# Altium schematic sheet Connector.SchDoc
size 431 x 279 mm; SheetNumber: 4; SheetTotal: 11
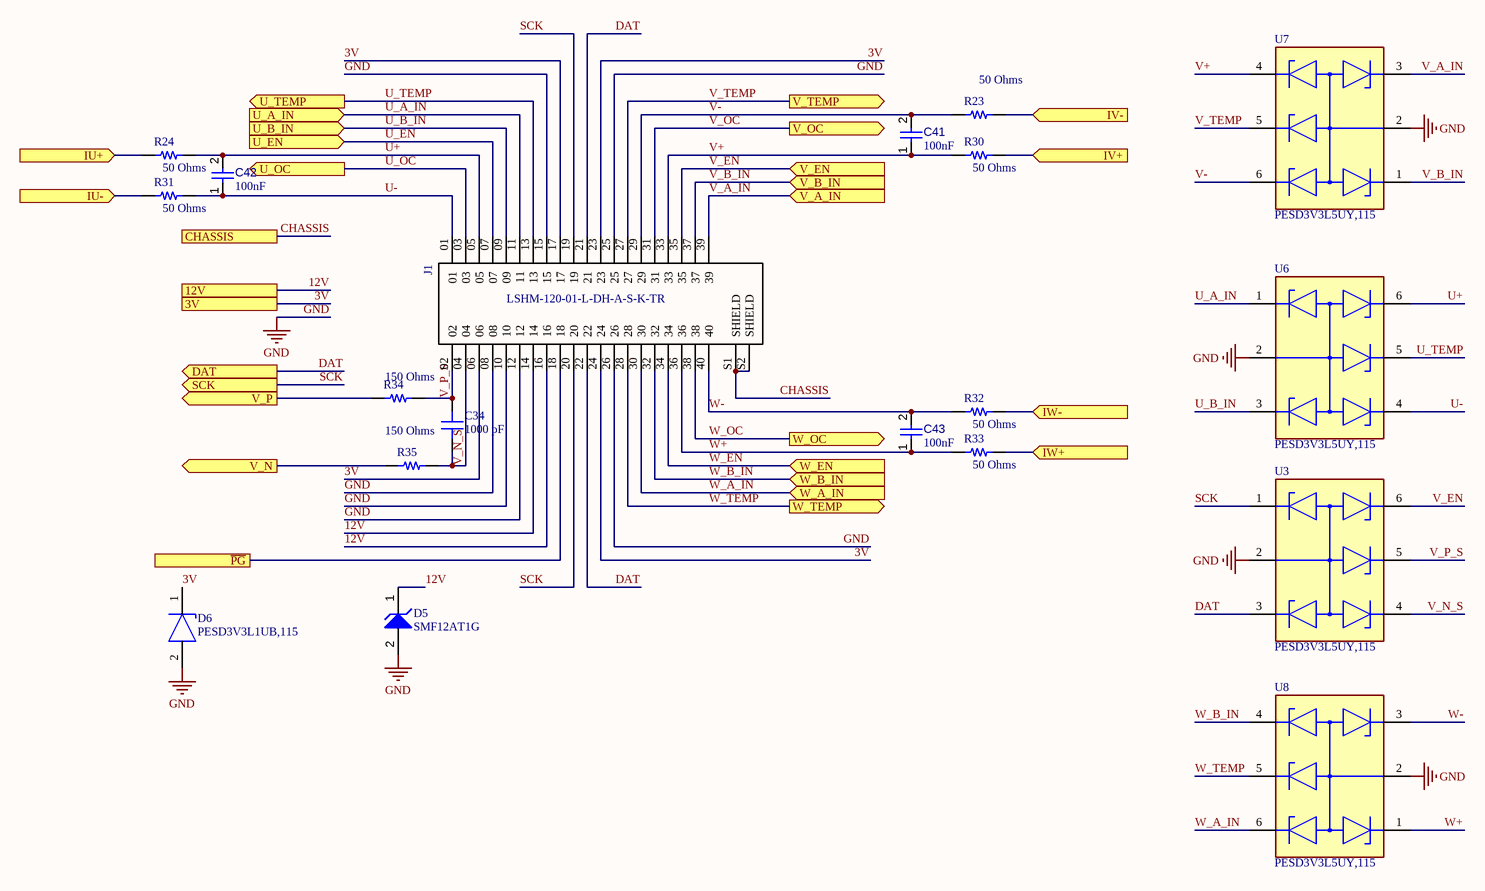
[diagram p0: Connector.SchDoc]

## Parts
C34  1000 pF  [CAP 0402_1005]
C41  value 100nF  [CAPC0402(1005)60_L]  (hidden comment: Capacitor 100nF +/-20% 10V 0402)
C42  value 100nF  [CAPC0402(1005)60_L]  (hidden comment: Capacitor 100nF +/-20% 10V 0402)
C43  value 100nF  [CAPC0402(1005)60_L]  (hidden comment: Capacitor 100nF +/-20% 10V 0402)
D5  SMF12AT1G  [ONSC-SOD-123FL-2-498_V]
D6  PESD3V3L1UB,115  [FP-SOD523-MFG]
J1  LSHM-120-01-L-DH-A-S-K-TR  [*SAMTEC_LSHM-120-01-L-DH-A-S-K-TR_LSHM-120-01-L-DH-A-S-K-TR(Primary)]
R23  50 Ohms  [RES 0402_1005]
R24  50 Ohms  [RES 0402_1005]
R30  50 Ohms  [RES 0402_1005]
R31  50 Ohms  [RES 0402_1005]
R32  50 Ohms  [RES 0402_1005]
R33  50 Ohms  [RES 0402_1005]
R34  150 Ohms  [RES 0402_1005]
R35  150 Ohms  [RES 0402_1005]
U3  PESD3V3L5UY,115  [FP-SOT363-IPC_A]
U6  PESD3V3L5UY,115  [FP-SOT363-IPC_A]
U7  PESD3V3L5UY,115  [FP-SOT363-IPC_A]
U8  PESD3V3L5UY,115  [FP-SOT363-IPC_A]

## Ports
3V, 12V, CHASSIS, DAT (out), IU+ (in), IU- (in), IV+ (in), IV- (in), IW+ (in), IW- (in), SCK (out), U_A_IN (in), U_B_IN (in), U_EN (in), U_OC (out), U_TEMP (out), V_A_IN (in), V_B_IN (in), V_EN (in), V_N (out), V_OC (out), V_P (out), V_TEMP (out), W_A_IN (in), W_B_IN (in), W_EN (in), W_OC (out), W_TEMP (out), ~{PG}

## Nets
GND: D5.2(A) D6.2(A) J1.08 J1.10 J1.12 J1.15 J1.25 J1.26 U3.2(COMMON_ANODE) U6.2(COMMON_ANODE) U7.2(COMMON_ANODE) U8.2(COMMON_ANODE)
3V: D6.1(C) J1.06 J1.17 J1.23 J1.24 ; port 3V
12V: D5.1(K) J1.14 J1.16 ; port 12V
CHASSIS: J1.S1(SHIELD) J1.S2(SHIELD) ; port CHASSIS
DAT: J1.21 J1.22 U3.3(CATHODE(DIODE_2)) ; port DAT
IU+: R24.1 ; port IU+
IU-: R31.1 ; port IU-
IV+: R30.2 ; port IV+
IV-: R23.2 ; port IV-
IW+: R33.2 ; port IW+
IW-: R32.2 ; port IW-
~{PG}: J1.18 ; port ~{PG}
SCK: J1.19 J1.20 U3.1(CATHODE(DIODE_1)) ; port SCK
U+: C42.2 J1.05 R24.2 U6.6(CATHODE(DIODE_5))
U-: C42.1 J1.01 R31.2 U6.4(CATHODE(DIODE_3))
U_A_IN: J1.11 U6.1(CATHODE(DIODE_1)) ; port U_A_IN
U_B_IN: J1.09 U6.3(CATHODE(DIODE_2)) ; port U_B_IN
U_EN: J1.07 ; port U_EN
U_OC: J1.03 ; port U_OC
U_TEMP: J1.13 U6.5(CATHODE(DIODE_4)) ; port U_TEMP
V+: C41.1 J1.33 R30.1 U7.4(CATHODE(DIODE_3))
V-: C41.2 J1.29 R23.1 U7.6(CATHODE(DIODE_5))
V_A_IN: J1.39 U7.3(CATHODE(DIODE_2)) ; port V_A_IN
V_B_IN: J1.37 U7.1(CATHODE(DIODE_1)) ; port V_B_IN
V_EN: J1.35 U3.6(CATHODE(DIODE_5)) ; port V_EN
V_N: R35.1 ; port V_N
V_N_S: C34.1 J1.04 R35.2 U3.4(CATHODE(DIODE_3))
V_OC: J1.31 ; port V_OC
V_P: R34.1 ; port V_P
V_P_S: C34.2 J1.02 R34.2 U3.5(CATHODE(DIODE_4))
V_TEMP: J1.27 U7.5(CATHODE(DIODE_4)) ; port V_TEMP
W+: C43.1 J1.36 R33.1 U8.1(CATHODE(DIODE_1))
W-: C43.2 J1.40 R32.1 U8.3(CATHODE(DIODE_2))
W_A_IN: J1.30 U8.6(CATHODE(DIODE_5)) ; port W_A_IN
W_B_IN: J1.32 U8.4(CATHODE(DIODE_3)) ; port W_B_IN
W_EN: J1.34 ; port W_EN
W_OC: J1.38 ; port W_OC
W_TEMP: J1.28 U8.5(CATHODE(DIODE_4)) ; port W_TEMP

## Notes on the sheet
- DWG. NO.
- REV.
- SHT.
- THIS DOCUMENT AND THE DATA DISCLOSED HEREIN OR HEREWITH IS THE PROPERTY OF ALTIUM LIMITED AND MAY BE FREELY DISTRIBUTED IN WHOLE. NO RIGHTS ARE RESERVED OR EXPRESS OR IMPLIED WARANTEE GIVEN.
- REVISION
- DESCRIPTION
- DATE
- APPROVED
- ENG:
- APPROVALS
- PROJECT
- DSN:
- CHK:
- REFERENCE DOCUMENTS
- PROJECT REVISION:
- TITLE
- DOCUMENT REVISION:
- DESIGN ITEM:
- BOM:
- FAB DWG:
- PCB DWG:
- ASSY DWG:
- SCALE:
- SIZE
- B
- CAGE CODE
- FILE NAME
- DWG NO.
- SHEET
- OF
- REV

## Library data of the parts
C34 = UMK105CG102JVHF: CAP CER 1000PF 50V C0G/NP0 0402; manufacturer: Taiyo Yuden; Temperature Coefficient: C0G, NP0; Tolerance: ±5%; Part Number: UMK105CG102JVHF; Capacitance: 1000 pF; Applications: Automotive; componentlink1description: Datasheet; componentlink1url: https://ds.yuden.co.jp/TYCOMPAS/ut/detail?pn=UMK105CG102JVHF &u=M; componentlink2description: DigiKey Link; componentlink2url: https://www.digikey.com/en/products/detail/taiyo-yuden/UMK105CG102JVHF/4811103; Device Package: 0402 (1005 Metric); lastupdated: 2/9/2024 8:04:38 PM; Lifecycle Status: Active; Minimum Order: 1; Mounting Type: Surface Mount, MLCC; Operating Temperature: -55°C ~ 125°C; Package / Case: 0402 (1005 Metric); packaging: TapeAndReel; partid: 1779; Part Status: Active; price: 0.01; Ratings: AEC-Q200; series: M; Size / Dimension: 0.039" L x 0.020" W (1.00mm x 0.50mm); Supplier 1: DigiKey; Supplier Part Number 1: 587-3737-1-ND; Thickness (Max): 0.022" (0.55mm); value: 1000 pF; Voltage - Rated: 50V
C41-C43 = CMP-001-00061-3: Chip Capacitor, 100nF +/-20%, 10V, 0402, Thickness 0.6 mm; Tolerance: 20%; Mounting Technology: SMT; Voltage Rating: 10V; Max Operating Temperature: 85°C; Pins: 2; Case/Package: 0402; Min Operating Temperature: -55°C
D5 = CMP-1061-00626-1: 200 W Transient Voltage Suppressor, 2-Pin SOD-123FL, Pb-Free, Tape and Reel; Manufacturer: On Semiconductor; Direction: Unidirectional; V(BR) Typ (V): 14; IR Max (uA): 2.5; PackageDescription: 2-Pin SOD, Body 1.65 x 2.7 mm; ComponentLink2URL: http://www.onsemi.com/pub_link/Collateral/SMF5.0AT1-D.PDF; DatasheetVersion: Rev. 7; PartNumber: SMF12AT1G; ComponentLink1Description: Manufacturer URL; ComponentLink2Description: Datasheet; ComponentLink1URL: http://www.onsemi.com/; ComponentLink3Description: Package Specification; Mounting Technology: Surface Mount; PackageReference: SOD-123FL-2-498; RoHS: Pb-Free; PackageVersion: Rev. D, 05/2013; Packing: Tape and Reel; ComponentLink3URL: http://www.onsemi.com/pub_link/Collateral/498-01.PDF
D6 = CMP-14432-000009-1: TVS DIODE 3.3VWM 11VC SOD523; RoHS Compliant: Yes
R23 = WR04X1500FTL: RES 150 OHM 1% 1/16W 0402; Manufacturer: Walsin Technology Corporation; Value: 50; Power (Watts): 0.063W, 1/16W; Resistance: 150 Ohms; Temperature Coefficient: ±100ppm/°C; Part Number: WR04X1500FTL; ComponentLink1Description: Datasheet; ComponentLink1URL: https://www.passivecomponent.com/wp-content/uploads/chipR/ASC_WR.pdf; ComponentLink2Description: DigiKey Link; ComponentLink2URL: https://www.digikey.com/en/products/detail/walsin-technology-corporation/WR04X1500FTL/13238657; Composition: Thick Film; Device Package: 0402 (1005 Metric); Height - Seated (Max): 0.016" (0.40mm); LastUpdated: 2/9/2024 8:28:55 PM; Lifecycle Status: Active; Minimum Order: 1; Number of Terminations: 2; Operating Temperature: -55°C ~ 155°C; Package / Case: 0402 (1005 Metric); Packaging: CutTape; PartId: 64765; Part Status: Active; Price: 0.01; Series: WR; Size / Dimension: 0.039" L x 0.020" W (1.00mm x 0.50mm); Supplier 1: DigiKey; Supplier Part Number 1: 1292-WR04X1500FTLCT-ND; Supplier Device Package: 0402; Tolerance: ±1%
R24 R30-R33 = WR04X1500FTL: RES 150 OHM 1% 1/16W 0402; Manufacturer: Walsin Technology Corporation; Power (Watts): 0.063W, 1/16W; Resistance: 150 Ohms; Temperature Coefficient: ±100ppm/°C; Part Number: WR04X1500FTL; Value: 50 Ohms; ComponentLink1Description: Datasheet; ComponentLink1URL: https://www.passivecomponent.com/wp-content/uploads/chipR/ASC_WR.pdf; ComponentLink2Description: DigiKey Link; ComponentLink2URL: https://www.digikey.com/en/products/detail/walsin-technology-corporation/WR04X1500FTL/13238657; Composition: Thick Film; Device Package: 0402 (1005 Metric); Height - Seated (Max): 0.016" (0.40mm); LastUpdated: 2/9/2024 8:28:55 PM; Lifecycle Status: Active; Minimum Order: 1; Number of Terminations: 2; Operating Temperature: -55°C ~ 155°C; Package / Case: 0402 (1005 Metric); Packaging: CutTape; PartId: 64765; Part Status: Active; Price: 0.01; Series: WR; Size / Dimension: 0.039" L x 0.020" W (1.00mm x 0.50mm); Supplier 1: DigiKey; Supplier Part Number 1: 1292-WR04X1500FTLCT-ND; Supplier Device Package: 0402; Tolerance: ±1%
R34 R35 = WR04X1500FTL: RES 150 OHM 1% 1/16W 0402; Manufacturer: Walsin Technology Corporation; Power (Watts): 0.063W, 1/16W; Temperature Coefficient: ±100ppm/°C; Part Number: WR04X1500FTL; Value: 150 Ohms; ComponentLink1Description: Datasheet; ComponentLink1URL: https://www.passivecomponent.com/wp-content/uploads/chipR/ASC_WR.pdf; ComponentLink2Description: DigiKey Link; ComponentLink2URL: https://www.digikey.com/en/products/detail/walsin-technology-corporation/WR04X1500FTL/13238657; Composition: Thick Film; Device Package: 0402 (1005 Metric); Height - Seated (Max): 0.016" (0.40mm); LastUpdated: 2/9/2024 8:28:55 PM; Lifecycle Status: Active; Minimum Order: 1; Number of Terminations: 2; Operating Temperature: -55°C ~ 155°C; Package / Case: 0402 (1005 Metric); Packaging: CutTape; PartId: 64765; Part Status: Active; Price: 0.01; Resistance: 150 Ohms; Series: WR; Size / Dimension: 0.039" L x 0.020" W (1.00mm x 0.50mm); Supplier 1: DigiKey; Supplier Part Number 1: 1292-WR04X1500FTLCT-ND; Supplier Device Package: 0402; Tolerance: ±1%
U3 U6-U8 = CMP-14432-000006-1: TVS DIODE 3.3VWM 12VC 6TSSOP; RoHS Compliant: Yes
J1 = LSHM-120-01-L-DH-A-S-K-TR: Value: *